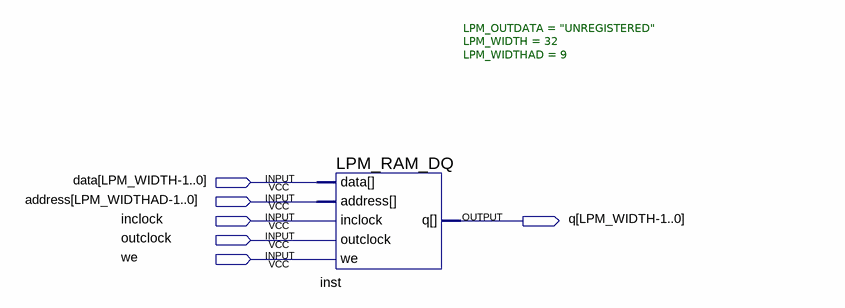
[diagram p0: schematic sheet]
// Quartus schematic Phase1Work.bdf as structural Verilog: 1 symbols, 6 pins
module Phase1Work (
  input  \data[LPM_WIDTH-1..0] ,
  input  \address[LPM_WIDTHAD-1..0] ,
  input  inclock,
  input  outclock,
  input  we,
  output \q[LPM_WIDTH-1..0] 
);

  LPM_RAM_DQ #(.LPM_OUTDATA("UNREGISTERED"), .LPM_WIDTH(32), .LPM_WIDTHAD(9)) inst (
    .inclock(inclock), .data({32{\data[LPM_WIDTH-1..0] }}), .address({9{\address[LPM_WIDTHAD-1..0] }}),
    .we(we), .outclock(outclock), .q(\q[LPM_WIDTH-1..0] ));
endmodule
